# EAGLE schematic SiliconLeaf (EAGLE 9.0.1)
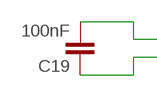
[diagram p0: schematic, sheet 1, part 1 of 2]
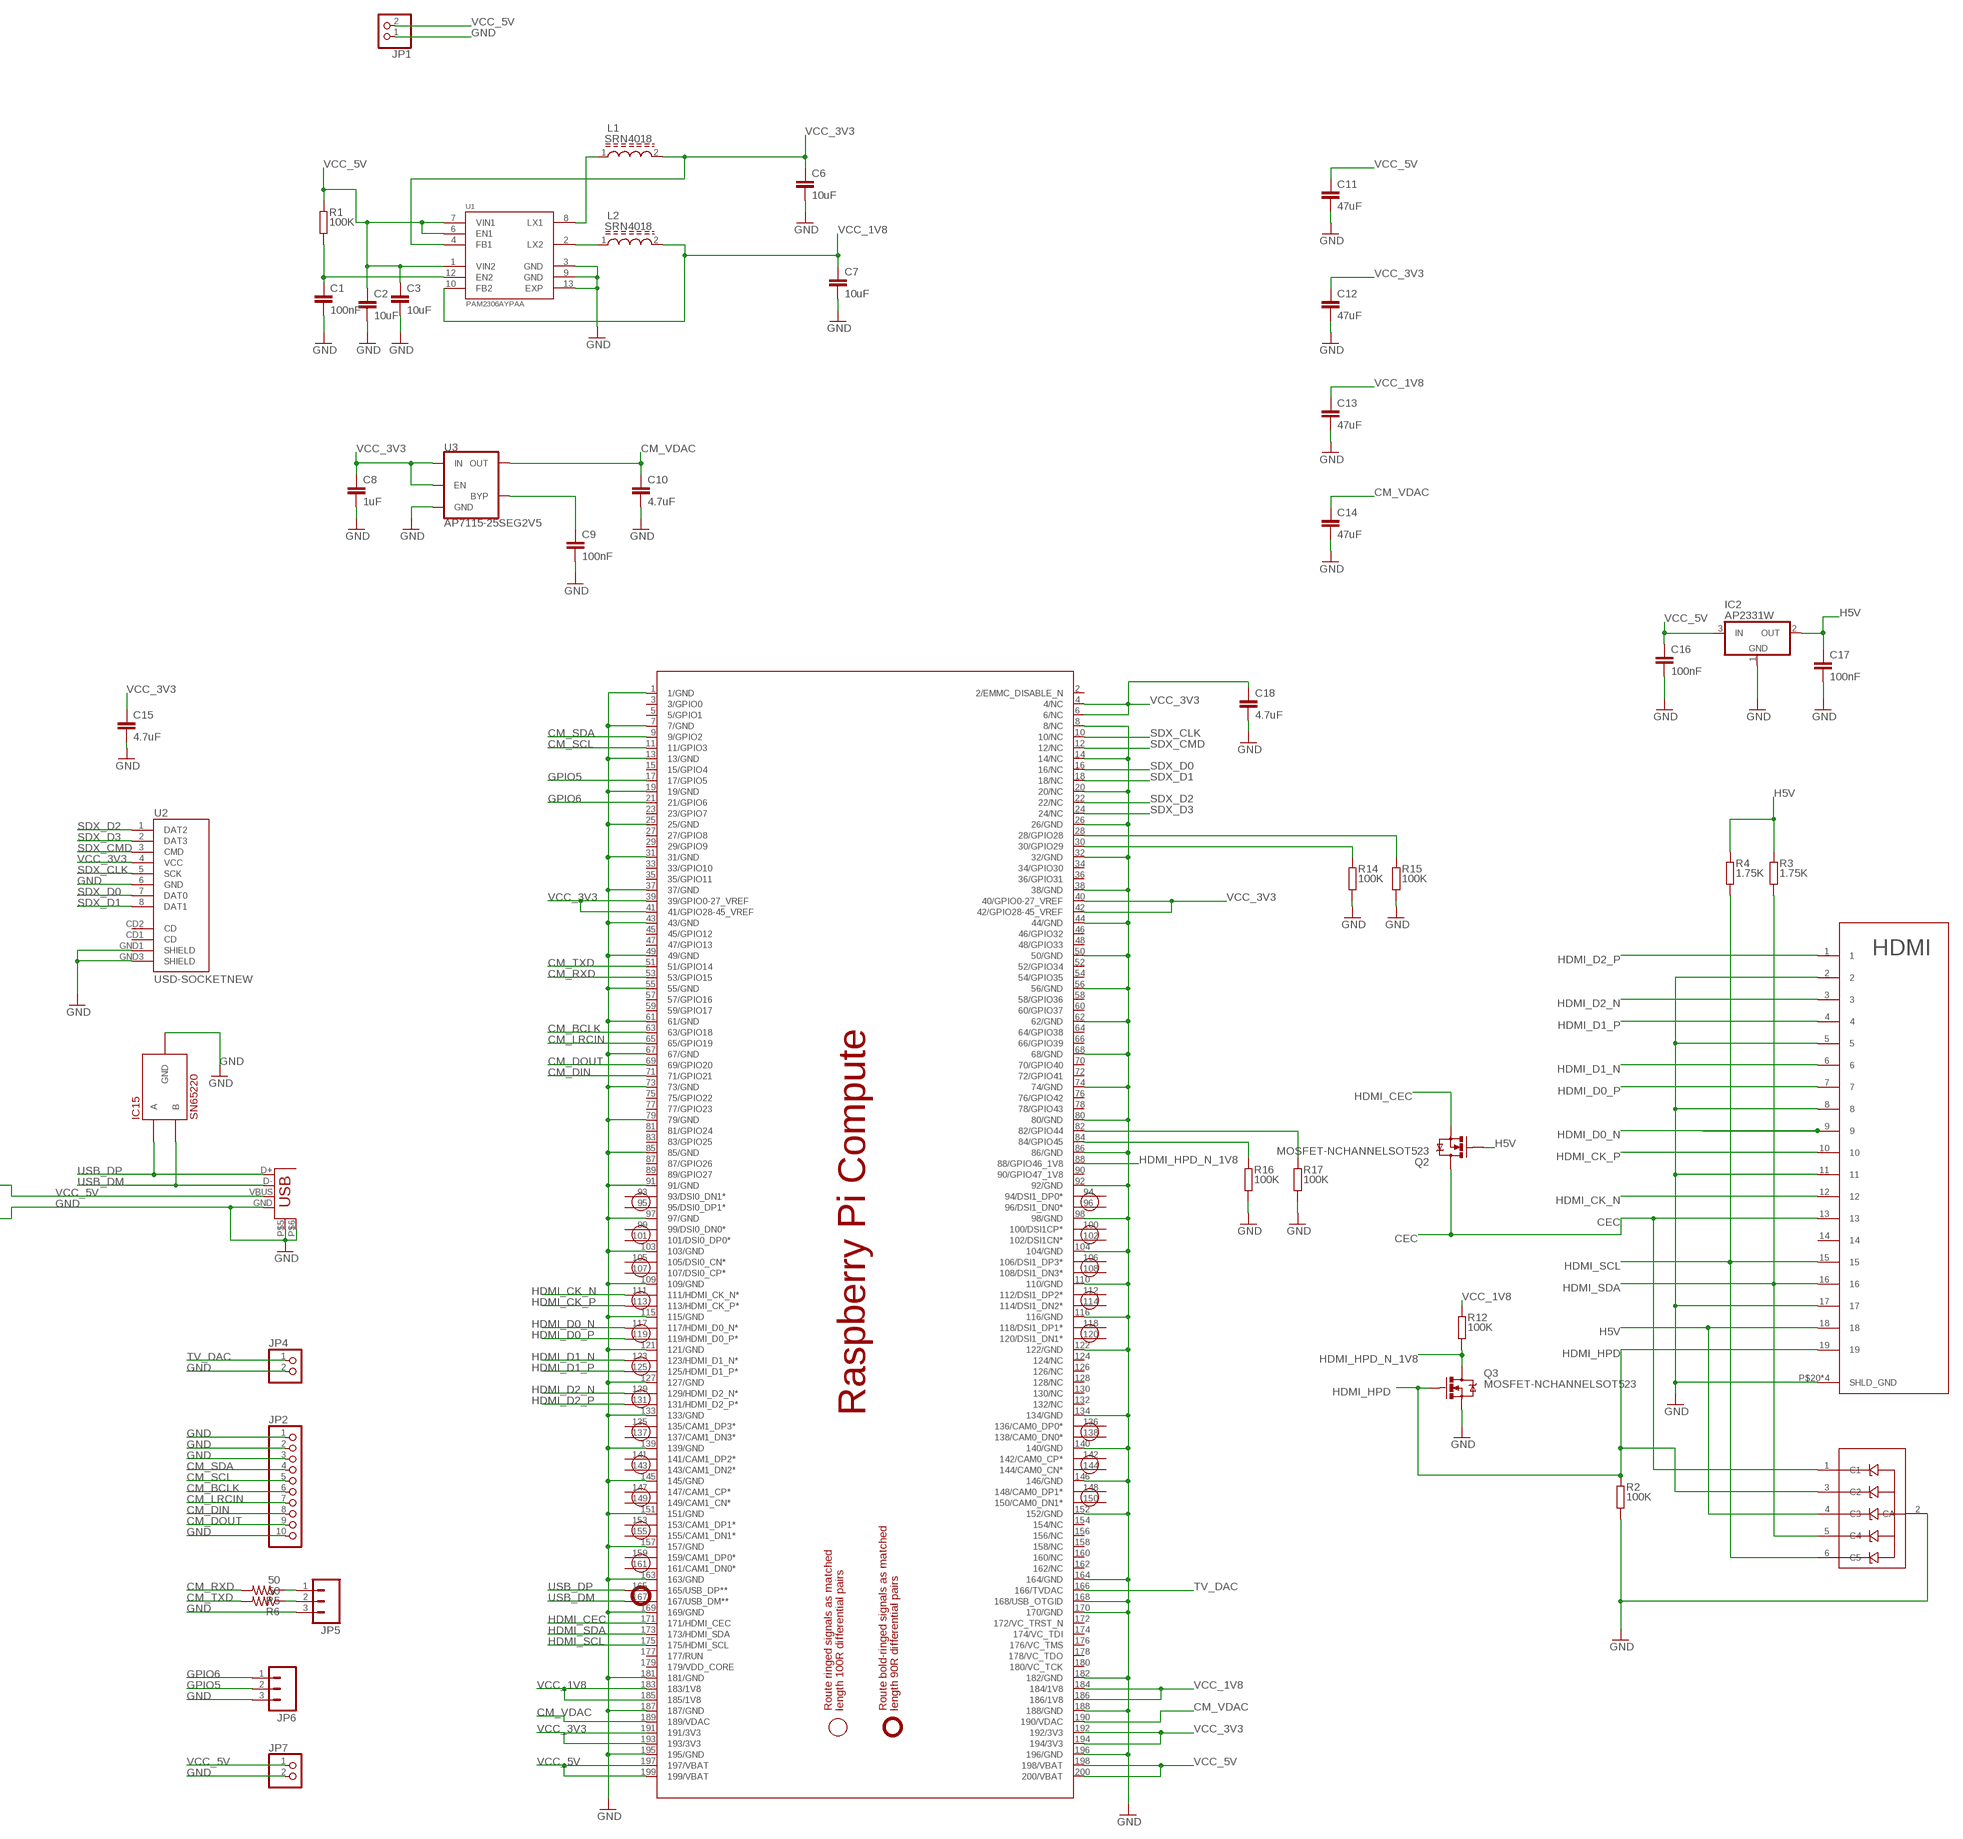
[diagram p1: schematic, sheet 1, part 2 of 2]

## Parts
C1  100nF  C-EUC0603  [C0603]
C2  10uF  C-EUC0805  [C0805]
C3  10uF  C-EUC0805  [C0805]
C6  10uF  C-EUC0805  [C0805]
C7  10uF  C-EUC0805  [C0805]
C8  1uF  C-EUC0603  [C0603]
C9  100nF  C-EUC0603  [C0603]
C10  4.7uF  C-EUC0603  [C0603]
C11  47uF  C-EUC3216  [C3216]
C12  47uF  C-EUC3216  [C3216]
C13  47uF  C-EUC3216  [C3216]
C14  47uF  C-EUC3216  [C3216]
C15  4.7uF  C-EUC0603  [C0603]
C16  100nF  C-EUC0603  [C0603]
C17  100nF  C-EUC0603  [C0603]
C18  4.7uF  C-EUC1608  [C1608]
C19  100nF  CAP0603-CAP  [0603-CAP]
IC1  PESD3V3L5UYSOT363  [SOT363-INFINION]
IC2  AP2331W  AP2331WCB  [SOT23]
IC15  SN65220  [SOT23-6L]
JP1  PINHD-1X2  [1X02]
JP2  PINHD-1X10  [1X10]
JP3  USB-A  USB-A-SMD  [USB-A-S-NOSILK-FEMALE]
JP4  PINHD-1X2  [1X02]
JP5  M03LOCK_LONGPADS  [1X03_LOCK_LONGPADS]
JP6  M03LOCK_LONGPADS  [1X03_LOCK_LONGPADS]
JP7  PINHD-1X2  [1X02]
L1  SRN4018  [INDP4040X180N]
L2  SRN4018  [INDP4040X180N]
Q2  MOSFET-NCHANNELSOT523  [SOT523]
Q3  MOSFET-NCHANNELSOT523  [SOT523]
R1  100K  R-EU_R0603  [R0603]
R2  100K  R-EU_R0603  [R0603]
R3  1.75K  R-EU_R0603  [R0603]
R4  1.75K  R-EU_R0603  [R0603]
R5  50  RESISTOR0603-RES  [0603-RES]
R6  50  RESISTOR0603-RES  [0603-RES]
R12  100K  R-EU_R0603  [R0603]
R14  100K  R-EU_R0603  [R0603]
R15  100K  R-EU_R0603  [R0603]
R16  100K  R-EU_R0603  [R0603]
R17  100K  R-EU_R0603  [R0603]
SODIMM  RPI_COMPUTE  [RPI_COMPUTE]
U1  PAM2306AYPAA  [SON45P300X300X80-13N]
U2  USD-SOCKETNEW  [MICRO-SD-SOCKET-PP]
U3  AP7115-25SEG2V5  [SC70]
U4  HDMI  [HDMI]

## Nets
CEC: IC1.1(C1) Q2.3(D) U4.13
CM_BCLK: JP2.6 SODIMM.63(63/GPIO18)
CM_DIN: JP2.8 SODIMM.71(71/GPIO21)
CM_DOUT: JP2.9 SODIMM.69(69/GPIO20)
CM_LRCIN: JP2.7 SODIMM.65(65/GPIO19)
CM_RXD: R5.2 SODIMM.53(53/GPIO15)
CM_SCL: JP2.5 SODIMM.11(11/GPIO3)
CM_SDA: JP2.4 SODIMM.9(9/GPIO2)
CM_TXD: R6.2 SODIMM.51(51/GPIO14)
CM_VDAC: C10.1 C14.1 SODIMM.189(189/VDAC) SODIMM.190(190/VDAC) U3.5(OUT)
GND: C1.2 C2.2 C3.2 C6.2 C7.2 C8.2 C9.2 C10.2 C11.2 C12.2 C13.2 C14.2 C15.2 C16.2 C17.2 C18.2 C19.1 IC1.2(CA) IC2.1(GND) IC15.2(GND) IC15.5(GND) JP1.1 JP2.1 JP2.2 JP2.3 JP2.10 JP3.GND JP3.P$5(SHIELD1) JP3.P$6(SHIELD2) JP4.2 JP5.3 JP6.3 JP7.2 Q3.2(S) R2.1 R14.1 R15.1 R16.1 R17.1 SODIMM.1(1/GND) SODIMM.7(7/GND) SODIMM.8(8/NC) SODIMM.13(13/GND) SODIMM.14(14/NC) SODIMM.19(19/GND) SODIMM.20(20/NC) SODIMM.25(25/GND) SODIMM.26(26/GND) SODIMM.31(31/GND) SODIMM.32(32/GND) SODIMM.37(37/GND) SODIMM.38(38/GND) SODIMM.43(43/GND) SODIMM.44(44/GND) SODIMM.49(49/GND) SODIMM.50(50/GND) SODIMM.55(55/GND) SODIMM.56(56/GND) SODIMM.61(61/GND) SODIMM.62(62/GND) SODIMM.67(67/GND) SODIMM.68(68/GND) SODIMM.73(73/GND) SODIMM.74(74/GND) SODIMM.79(79/GND) SODIMM.80(80/GND) SODIMM.85(85/GND) SODIMM.86(86/GND) SODIMM.91(91/GND) SODIMM.92(92/GND) SODIMM.97(97/GND) SODIMM.98(98/GND) SODIMM.103(103/GND) SODIMM.104(104/GND) SODIMM.109(109/GND) SODIMM.110(110/GND) SODIMM.115(115/GND) SODIMM.116(116/GND) SODIMM.121(121/GND) SODIMM.122(122/GND) SODIMM.127(127/GND) SODIMM.133(133/GND) SODIMM.134(134/GND) SODIMM.139(139/GND) SODIMM.140(140/GND) SODIMM.145(145/GND) SODIMM.146(146/GND) SODIMM.151(151/GND) SODIMM.152(152/GND) SODIMM.157(157/GND) SODIMM.163(163/GND) SODIMM.164(164/GND) SODIMM.168(168/USB_OTGID) SODIMM.169(169/GND) SODIMM.170(170/GND) SODIMM.181(181/GND) SODIMM.182(182/GND) SODIMM.187(187/GND) SODIMM.188(188/GND) SODIMM.195(195/GND) SODIMM.196(196/GND) U1.3(GND) U1.9(GND) U1.13(EXP) U2.6(GND) U2.GND1(SHIELD) U2.GND3(SHIELD) U3.2(GND) U4.2 U4.5 U4.8 U4.11 U4.17 U4.P$20(SHLD_GND) U4.P$21(SHLD_GND) U4.P$22(SHLD_GND) U4.P$23(SHLD_GND)
GPIO5: JP6.2 SODIMM.17(17/GPIO5)
GPIO6: JP6.1 SODIMM.21(21/GPIO6)
H5V: C17.1 IC1.4(C3) IC2.2(OUT) Q2.1(G) R3.2 R4.2 U4.18
HDMI_CEC: Q2.2(S) SODIMM.171(171/HDMI_CEC)
HDMI_CK_N: SODIMM.111(111/HDMI_CK_N*) U4.12
HDMI_CK_P: SODIMM.113(113/HDMI_CK_P*) U4.10
HDMI_D0_N: SODIMM.117(117/HDMI_D0_N*) U4.9
HDMI_D0_P: SODIMM.119(119/HDMI_D0_P*) U4.7
HDMI_D1_N: SODIMM.123(123/HDMI_D1_N*) U4.6
HDMI_D1_P: SODIMM.125(125/HDMI_D1_P*) U4.4
HDMI_D2_N: SODIMM.129(129/HDMI_D2_N*) U4.3
HDMI_D2_P: SODIMM.131(131/HDMI_D2_P*) U4.1
HDMI_HPD: IC1.3(C2) Q3.1(G) R2.2 U4.19
HDMI_HPD_N_1V8: Q3.3(D) R12.1 SODIMM.88(88/GPIO46_1V8)
HDMI_SCL: IC1.6(C5) R4.1 SODIMM.175(175/HDMI_SCL) U4.15
HDMI_SDA: IC1.5(C4) R3.1 SODIMM.173(173/HDMI_SDA) U4.16
N$1: L1.1 U1.8(LX1)
N$2: C1.1 R1.1 U1.12(EN2)
N$3: JP5.1 R5.1
N$4: JP5.2 R6.1
N$5: L2.1 U1.2(LX2)
N$7: C9.1 U3.4(BYP)
N$8: R16.2 SODIMM.84(84/GPIO45)
N$9: R15.2 SODIMM.28(28/GPIO28)
N$10: R14.2 SODIMM.30(30/GPIO29)
N$11: R17.2 SODIMM.82(82/GPIO44)
SDX_CLK: SODIMM.10(10/NC) U2.5(SCK)
SDX_CMD: SODIMM.12(12/NC) U2.3(CMD)
SDX_D0: SODIMM.16(16/NC) U2.7(DAT0)
SDX_D1: SODIMM.18(18/NC) U2.8(DAT1)
SDX_D2: SODIMM.22(22/NC) U2.1(DAT2)
SDX_D3: SODIMM.24(24/NC) U2.2(DAT3)
TV_DAC: JP4.1 SODIMM.166(166/TVDAC)
USB_DM: IC15.4(B) JP3.D- SODIMM.167(167/USB_DM**)
USB_DP: IC15.6(A) JP3.D+ SODIMM.165(165/USB_DP**)
VCC_1V8: C7.1 C13.1 L2.2 R12.2 SODIMM.183(183/1V8) SODIMM.184(184/1V8) SODIMM.185(185/1V8) SODIMM.186(186/1V8) U1.10(FB2)
VCC_3V3: C6.1 C8.1 C12.1 C15.1 C18.1 L1.2 SODIMM.4(4/NC) SODIMM.6(6/NC) SODIMM.39(39/GPIO0-27_VREF) SODIMM.40(40/GPIO0-27_VREF) SODIMM.41(41/GPIO28-45_VREF) SODIMM.42(42/GPIO28-45_VREF) SODIMM.191(191/3V3) SODIMM.192(192/3V3) SODIMM.193(193/3V3) SODIMM.194(194/3V3) U1.4(FB1) U2.4(VCC) U3.1(IN) U3.3(EN)
VCC_5V: C2.1 C3.1 C11.1 C16.1 C19.2 IC2.3(IN) JP1.2 JP3.VBUS JP7.1 R1.2 SODIMM.197(197/VBAT) SODIMM.198(198/VBAT) SODIMM.199(199/VBAT) SODIMM.200(200/VBAT) U1.1(VIN2) U1.6(EN1) U1.7(VIN1)
Unconnected: SODIMM.2(2/EMMC_DISABLE_N) SODIMM.3(3/GPIO0) SODIMM.5(5/GPIO1) SODIMM.15(15/GPIO4) SODIMM.23(23/GPIO7) SODIMM.27(27/GPIO8) SODIMM.29(29/GPIO9) SODIMM.33(33/GPIO10) SODIMM.34(34/GPIO30) SODIMM.35(35/GPIO11) SODIMM.36(36/GPIO31) SODIMM.45(45/GPIO12) SODIMM.46(46/GPIO32) SODIMM.47(47/GPIO13) SODIMM.48(48/GPIO33) SODIMM.52(52/GPIO34) SODIMM.54(54/GPIO35) SODIMM.57(57/GPIO16) SODIMM.58(58/GPIO36) SODIMM.59(59/GPIO17) SODIMM.60(60/GPIO37) SODIMM.64(64/GPIO38) SODIMM.66(66/GPIO39) SODIMM.70(70/GPIO40) SODIMM.72(72/GPIO41) SODIMM.75(75/GPIO22) SODIMM.76(76/GPIO42) SODIMM.77(77/GPIO23) SODIMM.78(78/GPIO43) SODIMM.81(81/GPIO24) SODIMM.83(83/GPIO25) SODIMM.87(87/GPIO26) SODIMM.89(89/GPIO27) SODIMM.90(90/GPIO47_1V8) SODIMM.93(93/DSI0_DN1*) SODIMM.94(94/DSI1_DP0*) SODIMM.95(95/DSI0_DP1*) SODIMM.96(96/DSI1_DN0*) SODIMM.99(99/DSI0_DN0*) SODIMM.100(100/DSI1CP*) SODIMM.101(101/DSI0_DP0*) SODIMM.102(102/DSI1CN*) SODIMM.105(105/DSI0_CN*) SODIMM.106(106/DSI1_DP3*) SODIMM.107(107/DSI0_CP*) SODIMM.108(108/DSI1_DN3*) SODIMM.112(112/DSI1_DP2*) SODIMM.114(114/DSI1_DN2*) SODIMM.118(118/DSI1_DP1*) SODIMM.120(120/DSI1_DN1*) SODIMM.124(124/NC) SODIMM.126(126/NC) SODIMM.128(128/NC) SODIMM.130(130/NC) SODIMM.132(132/NC) SODIMM.135(135/CAM1_DP3*) SODIMM.136(136/CAM0_DP0*) SODIMM.137(137/CAM1_DN3*) SODIMM.138(138/CAM0_DN0*) SODIMM.141(141/CAM1_DP2*) SODIMM.142(142/CAM0_CP*) SODIMM.143(143/CAM1_DN2*) SODIMM.144(144/CAM0_CN*) SODIMM.147(147/CAM1_CP*) SODIMM.148(148/CAM0_DP1*) SODIMM.149(149/CAM1_CN*) SODIMM.150(150/CAM0_DN1*) SODIMM.153(153/CAM1_DP1*) SODIMM.154(154/NC) SODIMM.155(155/CAM1_DN1*) SODIMM.156(156/NC) SODIMM.158(158/NC) SODIMM.159(159/CAM1_DP0*) SODIMM.160(160/NC) SODIMM.161(161/CAM1_DN0*) SODIMM.162(162/NC) SODIMM.172(172/VC_TRST_N) SODIMM.174(174/VC_TDI) SODIMM.176(176/VC_TMS) SODIMM.177(177/RUN) SODIMM.178(178/VC_TDO) SODIMM.179(179/VDD_CORE) SODIMM.180(180/VC_TCK) U2.CD1(CD) U2.CD2(CD) U4.14

## Library data of the parts
C1 C9 C16 C17 = rcl:C-EU: CAPACITOR, European symbol; CID: 67; SPICEPREFIX: C
C2 C3 C6 C7 = rcl:C-EU: CAPACITOR, European symbol; CID: 351; SPICEPREFIX: C
C8 = rcl:C-EU: CAPACITOR, European symbol; CID: 73; SPICEPREFIX: C
C10 C15 C18 = rcl:C-EU: CAPACITOR, European symbol; CID: 353; SPICEPREFIX: C
C11-C14 = rcl:C-EU: CAPACITOR, European symbol; CID: 355; SPICEPREFIX: C
C19 = osborn:CAP: Capacitor Standard 0603 ceramic capacitor, and 0.1" leaded capacitor.; CID: 67
IC1 = osborn:PESD3V3L5UY; CID: 360
IC2 = AP2331W:AP2331W: AP2331W 0.2A SINGLE CHANNEL CURRENT-LIMITED LOAD SWITCH; CID: 358
IC15 = osborn:SN65220; CID: 314
JP1 JP4 JP7 = osborn:PINHD-1X2: PIN HEADER
JP2 = pinhead:PINHD-1X10: PIN HEADER
JP3 = osborn:USB: USB Connectors USB-B-PTH is fully proven SKU : PRT-00139/CONN-08278 USB-miniB is fully proven SKU : PRT-00587 USB-A-PCB is untested. USB-A-H is throughly reviewed, but untested. Spark Fun Electronics SKU : PRT-00437 USB-B-SMT is throughly reviewed, but untested. Needs silkscreen touching up. USB-A-S has not been used/tested USB-MB-H has not been used/tested USB-MICROB has been used. CONN-09505; CID: 181; PROD_ID: CONN-09520
JP5 JP6 = osborn:M03: Header 3 Standard 3-pin 0.1" header. Use with straight break away headers (SKU : PRT-00116), right angle break away headers (PRT-00553), swiss pins (PRT-00743), machine pins (PRT-00117), and female headers (PRT-00115). Molex polarized connector foot print use with SKU : PRT-08232 with associated crimp pins and housings.
L1 L2 = SRN4018:SRN4018: Inductor Power Semi-Shielded Wirewound; CID: 352
Q2 Q3 = osborn:MOSFET-NCHANNEL: Common NMOSFET Parts MFG P/N Store ID Prod ID FDD8780 TRANS-09984 SI7820DN TRANS-11055 FDS6630A IC-08089 2N7002PW TRANS-11151 FQP30N06L COM-10213 TRANS-10060 BSS123LT1G TRANS-08345 BSS138 TRANS-00830 BS170 2N7000; CID: 359
R1 R2 R12 R14-R17 = rcl:R-EU_: RESISTOR, European symbol; CID: 157; SPICEPREFIX: R
R3 R4 = rcl:R-EU_: RESISTOR, European symbol; CID: 357; SPICEPREFIX: R
R5 R6 = osborn:RESISTOR: Resistor Basic schematic elements and footprints for 0603, 1206, and PTH resistors.; CID: 343; SUPPLIER: none
SODIMM = e14_Rpi_Compute_RevC:RPI_COMPUTE: Device for a Raspberry PI Compute module. Note that the package is for a DDR2 connector of 'standard' orientation. Example: TE Connectivity P/N: 1565917-4, Newark P/N: 08P0616, Farnell P/N: 2112525 More information is available at http://www.element14.com/community/community/raspberry-pi/raspberry-pi-compute-module; CID: 356
U1 = PAM2306AYPAA:PAM2306AYPAA: PAM2306 Series 5.5V 1A Dual High Efficiency PWM Step Down DC-DC Converter-WDFN12; AVAILABILITY: Good; CID: 362; DESCRIPTION: IC REG BUCK ADJ 1A DL SYNC 12DFN; MF: Diodes Inc.; MP: PAM2306AYPAA; PACKAGE: WFDFN-12 Diodes Inc.; PRICE: 0.33 USD
U2 = osborn:USD-SOCKET: microSD Socket Push-push type uSD socket. Schematic element and footprint production proven. Spark Fun Electronics SKU : PRT-00127. tDoc lines correctly indicate media card edge positions when inserting (unlocked, locked, depressed).; CID: 182
U3 = AP7115-25SEG:AP7115-25SEG: AP7115-25SEG 150mA LOW DROPOUT LINEAR REGULATOR WITH SHUTDOWN; CID: 354
U4 = 00_cody:HDMI; CID: 361